# EAGLE schematic schematic (EAGLE 9.3.0)
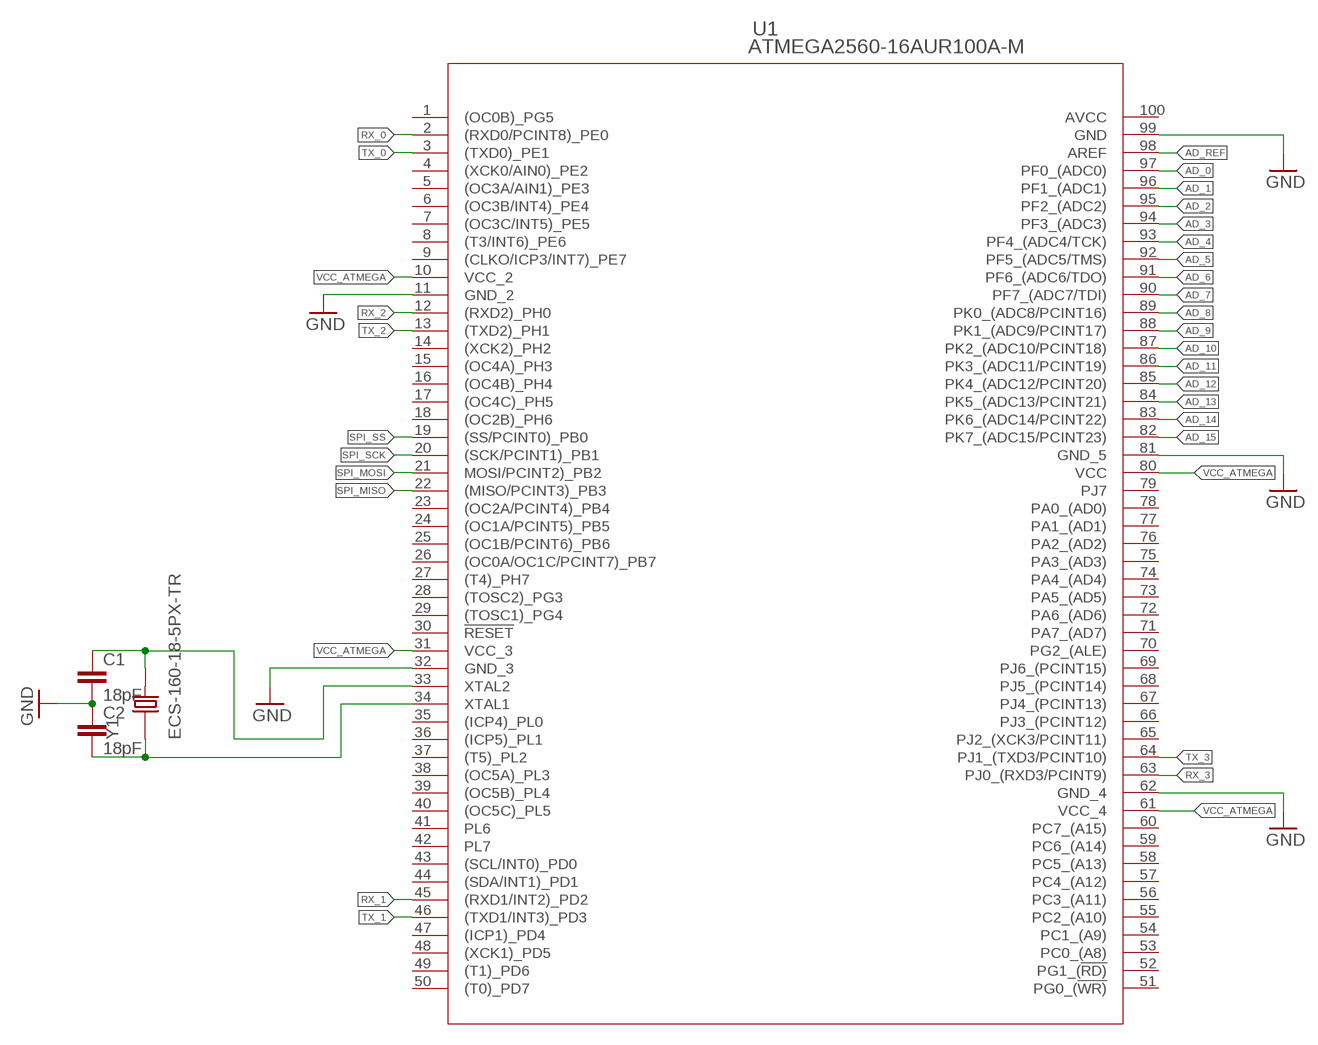
[diagram p0: schematic, sheet 1]

## Parts
C1  18pF  C-EUC0603  [C0603]
C2  18pF  C-EUC0603  [C0603]
U1  ATMEGA2560-16AUR100A-M  [100A-M]
Y1  ECS-160-18-5PX-TR  [XTAL_ECS-160-18-5PX-TR]

## Nets
AD_0: U1.97(PF0_(ADC0))
AD_1: U1.96(PF1_(ADC1))
AD_2: U1.95(PF2_(ADC2))
AD_3: U1.94(PF3_(ADC3))
AD_4: U1.93(PF4_(ADC4/TCK))
AD_5: U1.92(PF5_(ADC5/TMS))
AD_6: U1.91(PF6_(ADC6/TDO))
AD_7: U1.90(PF7_(ADC7/TDI))
AD_8: U1.89(PK0_(ADC8/PCINT16))
AD_9: U1.88(PK1_(ADC9/PCINT17))
AD_10: U1.87(PK2_(ADC10/PCINT18))
AD_11: U1.86(PK3_(ADC11/PCINT19))
AD_12: U1.85(PK4_(ADC12/PCINT20))
AD_13: U1.84(PK5_(ADC13/PCINT21))
AD_14: U1.83(PK6_(ADC14/PCINT22))
AD_15: U1.82(PK7_(ADC15/PCINT23))
AD_REF: U1.98(AREF)
GND: C1.2 C2.1 U1.11(GND_2) U1.32(GND_3) U1.62(GND_4) U1.81(GND_5) U1.99(GND)
N$1: C1.1 U1.33(XTAL2) Y1.2
N$2: C2.2 U1.34(XTAL1) Y1.1
RX_0: U1.2((RXD0/PCINT8)_PE0)
RX_1: U1.45((RXD1/INT2)_PD2)
RX_2: U1.12((RXD2)_PH0)
RX_3: U1.63(PJ0_(RXD3/PCINT9))
SPI_MISO: U1.22((MISO/PCINT3)_PB3)
SPI_MOSI: U1.21(MOSI/PCINT2)_PB2)
SPI_SCK: U1.20((SCK/PCINT1)_PB1)
SPI_SS: U1.19((SS/PCINT0)_PB0)
TX_0: U1.3((TXD0)_PE1)
TX_1: U1.46((TXD1/INT3)_PD3)
TX_2: U1.13((TXD2)_PH1)
TX_3: U1.64(PJ1_(TXD3/PCINT10))
VCC_ATMEGA: U1.10(VCC_2) U1.31(VCC_3) U1.61(VCC_4) U1.80(VCC)
Unconnected: U1.1((OC0B)_PG5) U1.4((XCK0/AIN0)_PE2) U1.5((OC3A/AIN1)_PE3) U1.6((OC3B/INT4)_PE4) U1.7((OC3C/INT5)_PE5) U1.8((T3/INT6)_PE6) U1.9((CLKO/ICP3/INT7)_PE7) U1.14((XCK2)_PH2) U1.15((OC4A)_PH3) U1.16((OC4B)_PH4) U1.17((OC4C)_PH5) U1.18((OC2B)_PH6) U1.23((OC2A/PCINT4)_PB4) U1.24((OC1A/PCINT5)_PB5) U1.25((OC1B/PCINT6)_PB6) U1.26((OC0A/OC1C/PCINT7)_PB7) U1.27((T4)_PH7) U1.28((TOSC2)_PG3) U1.29((TOSC1)_PG4) U1.30(!RESET) U1.35((ICP4)_PL0) U1.36((ICP5)_PL1) U1.37((T5)_PL2) U1.38((OC5A)_PL3) U1.39((OC5B)_PL4) U1.40((OC5C)_PL5) U1.41(PL6) U1.42(PL7) U1.43((SCL/INT0)_PD0) U1.44((SDA/INT1)_PD1) U1.47((ICP1)_PD4) U1.48((XCK1)_PD5) U1.49((T1)_PD6) U1.50((T0)_PD7) U1.51(PG0_(!WR)) U1.52(PG1_(!RD)) U1.53(PC0_(A8)) U1.54(PC1_(A9)) U1.55(PC2_(A10)) U1.56(PC3_(A11)) U1.57(PC4_(A12)) U1.58(PC5_(A13)) U1.59(PC6_(A14)) U1.60(PC7_(A15)) U1.65(PJ2_(XCK3/PCINT11)) U1.66(PJ3_(PCINT12)) U1.67(PJ4_(PCINT13)) U1.68(PJ5_(PCINT14)) U1.69(PJ6_(PCINT15)) U1.70(PG2_(ALE)) U1.71(PA7_(AD7)) U1.72(PA6_(AD6)) U1.73(PA5_(AD5)) U1.74(PA4_(AD4)) U1.75(PA3_(AD3)) U1.76(PA2_(AD2)) U1.77(PA1_(AD1)) U1.78(PA0_(AD0)) U1.79(PJ7) U1.100(AVCC)

## Library data of the parts
C1 C2 = rcl:C-EU: CAPACITOR, European symbol; SPICEPREFIX: C
U1 = projectLibraries:ATMEGA2560-16AUR; MANUFACTURER_PART_NUMBER: ATMEGA256016AUR; VENDOR: Atmel
Y1 = 16MHzXTAL:ECS-160-18-5PX-TR: CRYSTAL SMD; DESCRIPTION: CSM-7X Series 16 MHz ±30 ppm 18 pF -10 to +70°C Surface Mount Quartz Crystal; DIGI-KEY_PART_NUMBER: XC2081CT-ND; DIGI-KEY_PURCHASE_URL: https://www.digikey.co.uk/product-detail/en/ecs-inc/ECS-160-18-5PX-TR/XC2081CT-ND/5875565?utm_source=snapeda&utm_medium=aggregator&utm_campaign=symbol; MF: ECS Inc.; MP: ECS-160-18-5PX-TR; PACKAGE: HC-49/US ECS International